# Altium schematic sheet P05.SDRAM.SchDoc
size A4
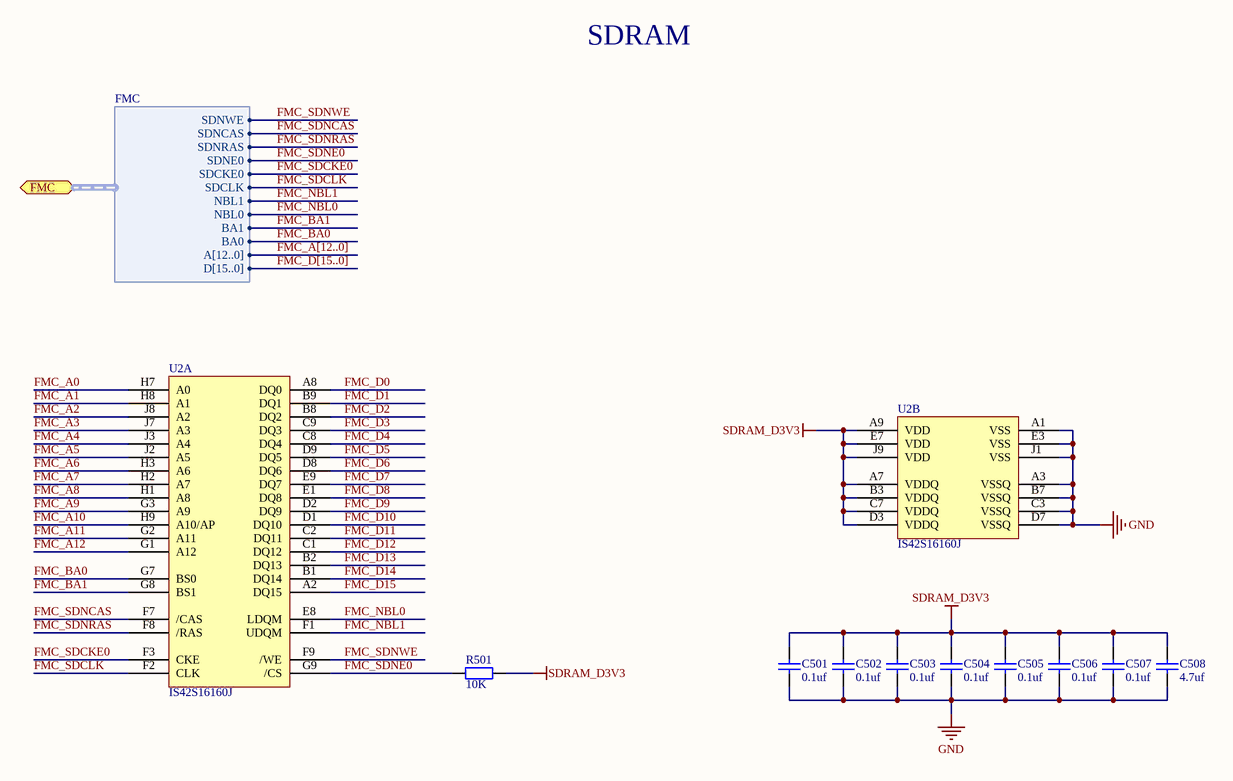
[diagram p0: P05.SDRAM.SchDoc]

## Parts
C501  value 0.1uf  [C0402]  (hidden comment: Cap)
C502  value 0.1uf  [C0402]  (hidden comment: Cap)
C503  value 0.1uf  [C0402]  (hidden comment: Cap)
C504  value 0.1uf  [C0402]  (hidden comment: Cap)
C505  value 0.1uf  [C0402]  (hidden comment: Cap)
C506  value 0.1uf  [C0402]  (hidden comment: Cap)
C507  value 0.1uf  [C0402]  (hidden comment: Cap)
C508  value 4.7uf  [C0603]  (hidden comment: Cap)
R501  value 10K  [R0603]  (hidden comment: Res)
U2  IS42S16160J  [IS42S16160J-TFBGA54]  (parts A,B of 2)

## Ports
FMC (bidir, harness FMC)

## Harnesses
FMC: SDNWE, SDNCAS, SDNRAS, SDNE0, SDCKE0, SDCLK, NBL1, NBL0, BA1, BA0, A[12..0], D[15..0]

## Nets
GND: C501.1 C502.1 C503.1 C504.1 C505.1 C506.1 C507.1 C508.1 U2.A1(VSS) U2.A3(VSSQ) U2.B7(VSSQ) U2.C3(VSSQ) U2.D7(VSSQ) U2.E3(VSS) U2.J1(VSS)
SDRAM_D3V3: C501.2 C502.2 C503.2 C504.2 C505.2 C506.2 C507.2 C508.2 R501.2 U2.A7(VDDQ) U2.A9(VDD) U2.B3(VDDQ) U2.C7(VDDQ) U2.D3(VDDQ) U2.E7(VDD) U2.J9(VDD)
FMC_A0: U2.H7(A0)
FMC_A1: U2.H8(A1)
FMC_A2: U2.J8(A2)
FMC_A3: U2.J7(A3)
FMC_A4: U2.J3(A4)
FMC_A5: U2.J2(A5)
FMC_A6: U2.H3(A6)
FMC_A7: U2.H2(A7)
FMC_A8: U2.H1(A8)
FMC_A9: U2.G3(A9)
FMC_A10: U2.H9(A10/AP)
FMC_A11: U2.G2(A11)
FMC_A12: U2.G1(A12)
FMC_BA0: U2.G7(BS0) ; port FMC.BA0
FMC_BA1: U2.G8(BS1) ; port FMC.BA1
FMC_D0: U2.A8(DQ0)
FMC_D1: U2.B9(DQ1)
FMC_D2: U2.B8(DQ2)
FMC_D3: U2.C9(DQ3)
FMC_D4: U2.C8(DQ4)
FMC_D5: U2.D9(DQ5)
FMC_D6: U2.D8(DQ6)
FMC_D7: U2.E9(DQ7)
FMC_D8: U2.E1(DQ8)
FMC_D9: U2.D2(DQ9)
FMC_D10: U2.D1(DQ10)
FMC_D11: U2.C2(DQ11)
FMC_D12: U2.C1(DQ12)
FMC_D13: U2.B2(DQ13)
FMC_D14: U2.B1(DQ14)
FMC_D15: U2.A2(DQ15)
FMC_NBL0: U2.E8(LDQM) ; port FMC.NBL0
FMC_NBL1: U2.F1(UDQM) ; port FMC.NBL1
FMC_SDCKE0: U2.F3(CKE) ; port FMC.SDCKE0
FMC_SDCLK: U2.F2(CLK) ; port FMC.SDCLK
FMC_SDNCAS: U2.F7(/CAS) ; port FMC.SDNCAS
FMC_SDNE0: R501.1 U2.G9(/CS) ; port FMC.SDNE0
FMC_SDNRAS: U2.F8(/RAS) ; port FMC.SDNRAS
FMC_SDNWE: U2.F9(/WE) ; port FMC.SDNWE

## Buses and harness runs
bus FMC_A[12..0]
bus FMC_D[15..0]

## Notes on the sheet
- SDRAM

## Library data of the parts
R501 = Res: 电阻
U2 = IS42S16160J: 32Meg x 8, 16Meg x16, 256Mb SYNCHRONOUS DRAM